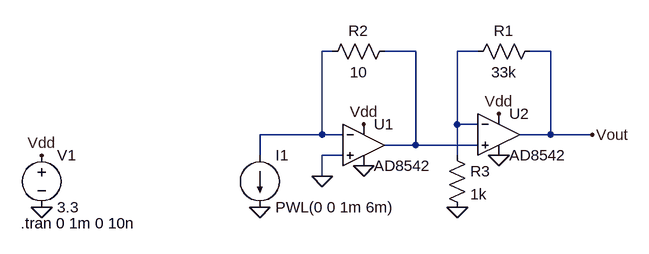
[diagram p0: schematic PhotodiodeAmplifier.asc]
PhotodiodeAmplifier.asc, the LTspice schematic file:
Version 4
SHEET 1 880 680
WIRE 96 48 80 48
WIRE 224 48 176 48
WIRE 320 48 288 48
WIRE 432 48 400 48
WIRE 288 160 288 48
WIRE 320 160 288 160
WIRE 80 176 80 48
WIRE 80 176 -16 176
WIRE 112 176 80 176
WIRE 432 176 432 48
WIRE 432 176 384 176
WIRE 496 176 432 176
WIRE 224 192 224 48
WIRE 224 192 176 192
WIRE 320 192 224 192
WIRE -16 208 -16 176
WIRE 112 208 80 208
WIRE 288 208 288 160
WIRE 80 240 80 208
FLAG 352 208 0
FLAG 144 224 0
FLAG 80 240 0
FLAG 288 288 0
FLAG -16 288 0
FLAG 496 176 Vout
FLAG -352 288 0
FLAG -352 208 Vdd
FLAG 144 160 Vdd
FLAG 352 144 Vdd
SYMBOL Opamps\\AD8542 144 128 R0
SYMATTR InstName U1
SYMBOL Opamps\\AD8542 352 112 R0
SYMATTR InstName U2
SYMBOL res 416 32 R90
WINDOW 0 0 56 VBottom 2
WINDOW 3 32 56 VTop 2
SYMATTR InstName R1
SYMATTR Value 33k
SYMBOL res 192 32 R90
WINDOW 0 0 56 VBottom 2
WINDOW 3 32 56 VTop 2
SYMATTR InstName R2
SYMATTR Value 10
SYMBOL res 272 192 R0
SYMATTR InstName R3
SYMATTR Value 1k
SYMBOL current -16 208 R0
WINDOW 123 0 0 Left 0
WINDOW 39 0 0 Left 0
SYMATTR InstName I1
SYMATTR Value PWL(0 0 1m 6m)
SYMBOL voltage -352 192 R0
WINDOW 123 0 0 Left 0
WINDOW 39 0 0 Left 0
SYMATTR InstName V1
SYMATTR Value 3.3
TEXT -384 312 Left 2 !.tran 0 1m 0 10n

The netlist it stands for:
* PhotodiodeAmplifier.asc
XU1 0 N001 Vdd 0 N002 AD8542  ; pins In+ In- V+ V- OUT
XU2 N002 N003 Vdd 0 Vout AD8542  ; pins In+ In- V+ V- OUT
R1 Vout N003 33k
R2 N002 N001 10
R3 N003 0 1k
I1 N001 0 PWL(0 0 1m 6m)
V1 Vdd 0 3.3
.tran 0 1m 0 10n
.lib AD8542.sub
.backanno
.end